# EAGLE schematic neural_network (EAGLE 9.0.0)
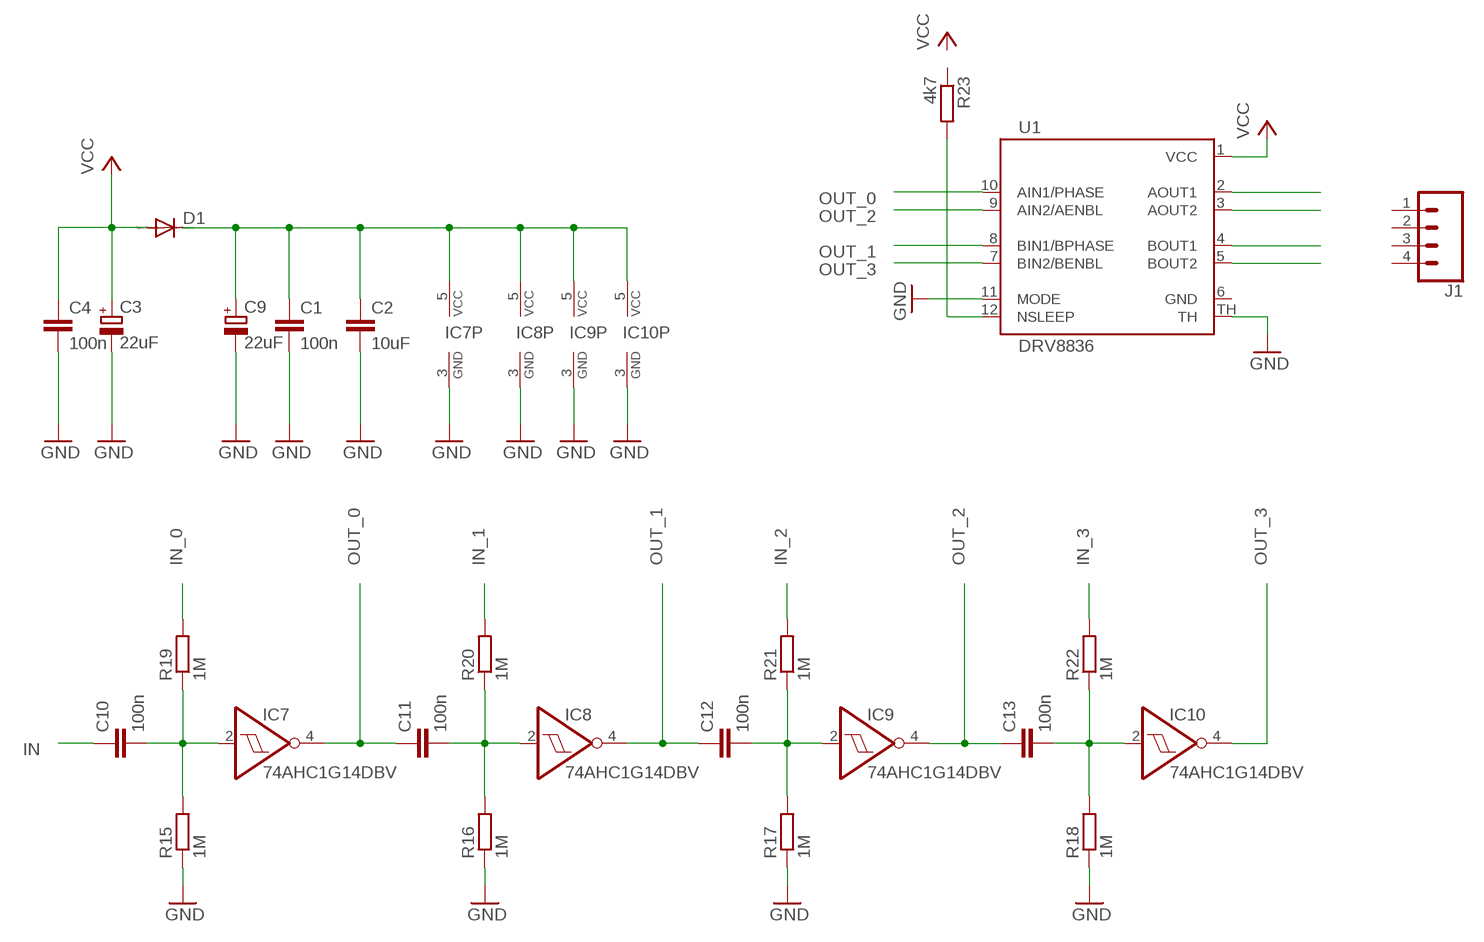
[diagram p0: schematic, sheet 1]

## Parts
C1  100n  C-EUC0805  [C0805]
C2  10uF  C-EUC0805  [C0805]
C3  22uF  CPOL-EU153CLV-0605  [153CLV-0605]
C4  100n  C-EUC0805  [C0805]
C9  22uF  CPOL-EU153CLV-0605  [153CLV-0605]
C10  100n  C-EUC0805  [C0805]
C11  100n  C-EUC0805  [C0805]
C12  100n  C-EUC0805  [C0805]
C13  100n  C-EUC0805  [C0805]
D1  DIODE-DO214AA  [DO214AA]
IC7  74AHC1G14DBV  [SOT23-5]
IC8  74AHC1G14DBV  [SOT23-5]
IC9  74AHC1G14DBV  [SOT23-5]
IC10  74AHC1G14DBV  [SOT23-5]
J1  CONN_04  [1X04]
R15  1M  R-EU_M0805  [M0805]
R16  1M  R-EU_M0805  [M0805]
R17  1M  R-EU_M0805  [M0805]
R18  1M  R-EU_M0805  [M0805]
R19  1M  R-EU_M0805  [M0805]
R20  1M  R-EU_M0805  [M0805]
R21  1M  R-EU_M0805  [M0805]
R22  1M  R-EU_M0805  [M0805]
R23  4k7  R-EU_M0805  [M0805]
U1  DRV8836  [12WSON]

## Nets
GND: C1.2 C2.2 C3.- C4.2 C9.- IC7.3(GND) IC8.3(GND) IC9.3(GND) IC10.3(GND) R15.1 R16.1 R17.1 R18.1 U1.11(MODE) U1.TH
IN: C10.1
IN_0: R19.2
IN_1: R20.2
IN_2: R21.2
IN_3: R22.2
N$1: C1.1 C2.1 C9.+ D1.C IC7.5(VCC) IC8.5(VCC) IC9.5(VCC) IC10.5(VCC)
N$14: C10.2 IC7.2(I) R15.2 R19.1
N$17: C11.2 IC8.2(I) R16.2 R20.1
N$20: C12.2 IC9.2(I) R17.2 R21.1
N$23: C13.2 IC10.2(I) R18.2 R22.1
N$32: R23.2 U1.12(NSLEEP)
N$33: U1.3(AOUT2)
N$36: U1.2(AOUT1)
N$37: U1.4(BOUT1)
N$38: U1.5(BOUT2)
OUT_0: C11.1 IC7.4(O) U1.10(AIN1/PHASE)
OUT_1: C12.1 IC8.4(O) U1.8(BIN1/BPHASE)
OUT_2: C13.1 IC9.4(O) U1.9(AIN2/AENBL)
OUT_3: IC10.4(O) U1.7(BIN2/BENBL)
VCC: C3.+ C4.1 D1.A U1.1(VCC)
Unconnected: J1.1 J1.2 J1.3 J1.4 R23.1 U1.6(GND)

## Library data of the parts
C1 C2 C4 C10-C13 = resistor:C-EU: CAPACITOR, European symbol
C3 C9 = resistor:CPOL-EU: POLARIZED CAPACITOR, European symbol
D1 = diode:DIODE-: DIODE
IC7-IC10 = 74xx-little-de:74*1G14: Single Schmitt-Trigger Inverter Gate
J1 = SparkFun-Connectors:CONN_04: Multi connection point. Often used as Generic Header-pin footprint for 0.1 inch spaced/style header connections On any of the 0.1 inch spaced packages, you can populate with these: Break Away Headers - Straight <https://www.sparkfun.com/products/116> (PRT-00116) Break Away Male Headers - Right Angle <https://www.sparkfun.com/products/553> (PRT-00553) Female Headers <https://www.sparkfun.com/products/115> (PRT-00115) Break Away Headers - Machine Pin <https://www.sparkfun.com/products/117> (PRT-00117) Break Away Female Headers - Swiss Machine Pin <https://www.sparkfun.com/products/743> (PRT-00743) For SCREWTERMINALS and SPRING TERMINALS visit here: Screw Terimnals on SparkFun.com <https://www.sparkfun.com/search/results?term=Screw+Terminals> (5mm/3.5mm/2.54mm spacing) This device is also useful as a general connection point to wire up your design to another part of your project. Our various solder wires solder well into these plated through hole pads. Hook-Up Wire - Assortment (Stranded, 22 AWG) <https://www.sparkfun.com/products/11375> (PRT-11375) Hook-Up Wire - Assortment (Solid Core, 22 AWG) <https://www.sparkfun.com/products/11367> (PRT-11367) View the entire wire category on our website here <https://www.sparkfun.com/categories/141> Special notes: Molex polarized connector foot print use with SKU : PRT-08231 with associated crimp pins and housings. 1MM SMD Version SKU: PRT-10208; PROD_ID: CONN-09696
R15-R23 = resistor:R-EU_: RESISTOR, European symbol
U1 = balto:DRV8836: Dual low voltage H-Bridge IC